# EAGLE design Beacon_controller_ESP32 (EAGLE 9.2.2)
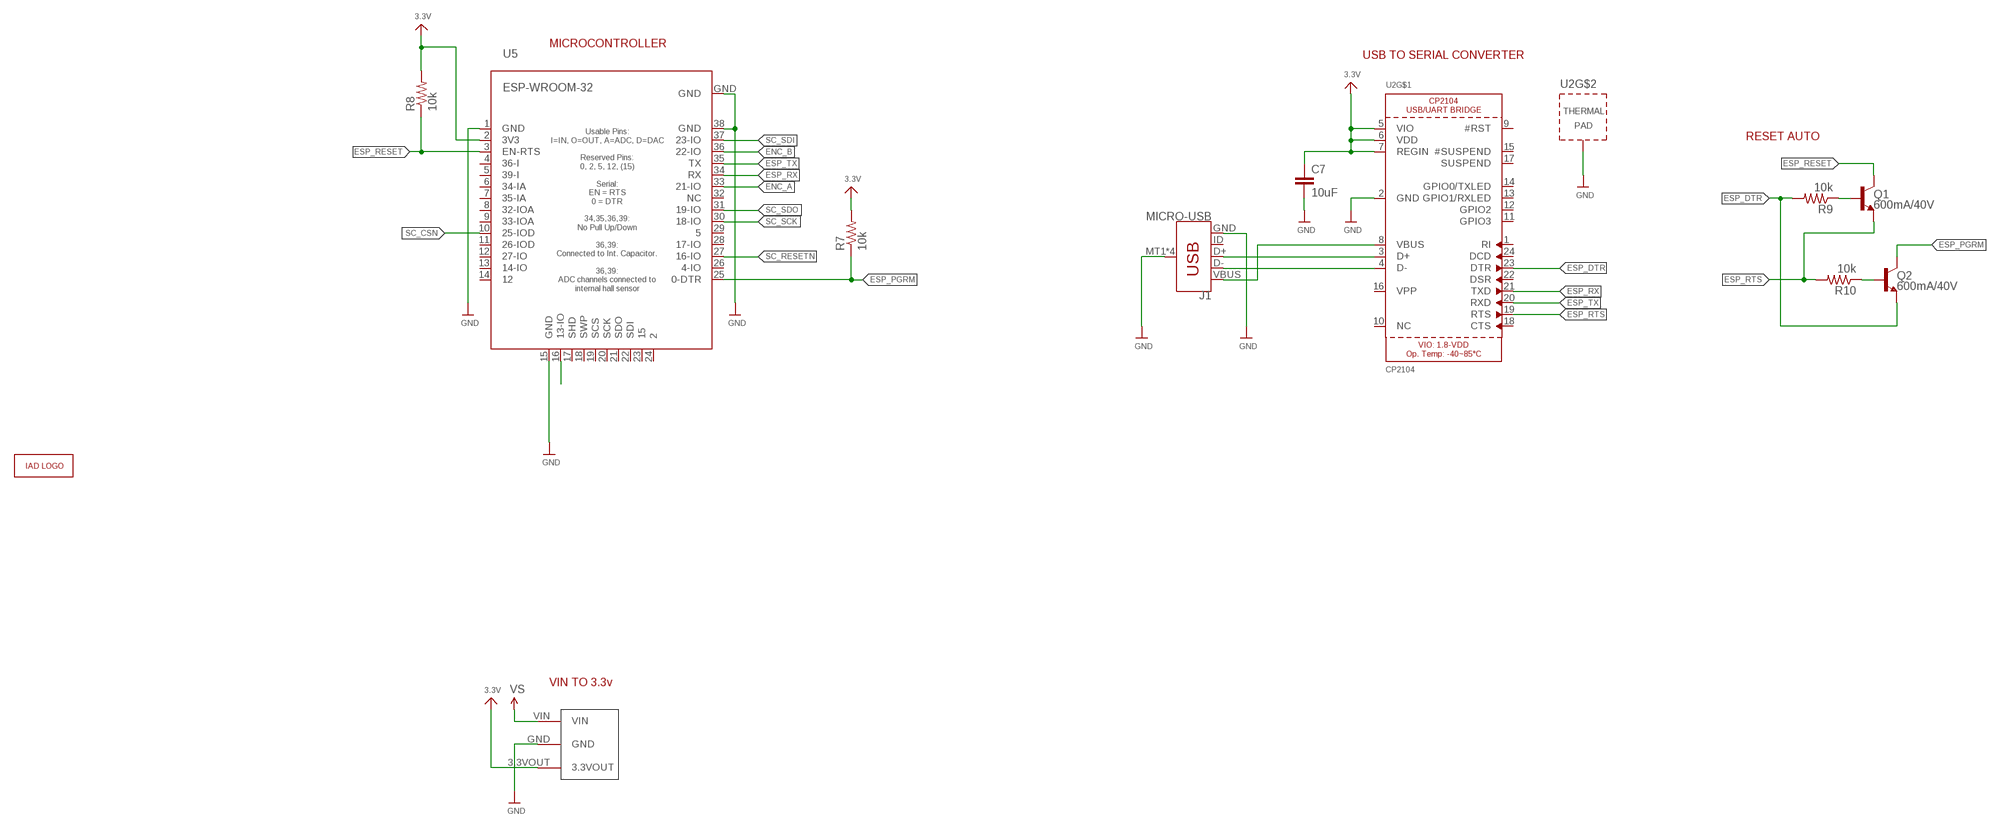
[diagram p0: schematic, sheet 1]

## Parts
A1  ZHDK_LOGO_METAL  [ZHDK_LOGO]
C7  10uF  10UF-0603-6.3V-20%  [0603]
J1  MICRO-USB  USB_MICRO-B_SMT  [USB-MICROB]
Q1  600mA/40V  TRANS_NPN-MMBT2222AL  [SOT23-3]
Q2  600mA/40V  TRANS_NPN-MMBT2222AL  [SOT23-3]
R7  10k  RESISTOR0603-RES  [0603-RES]
R8  10k  RESISTOR0603-RES  [0603-RES]
R9  10k  RESISTOR0603-RES  [0603-RES]
R10  10k  RESISTOR0603-RES  [0603-RES]
U2  CP2104  [QFN24_4MM_SMSC]
U4  TRACO12433  [TRACO12433]
U5  ESP-WROOM-32  [ESP-WROOM-32]

## Nets
3.3V: C7.1 R7.2 R8.2 U2.5(VIO) U2.6(VDD) U2.7(REGIN) U4.3.3VOUT U5.2(3V3)
BTN_HOME: U5.16(13-IO)
ENC_A: U5.33(21-IO)
ENC_B: U5.36(22-IO)
ESP_DTR: Q2.2(E) R9.2 U2.23(DTR)
ESP_PGRM: Q2.3(C) R7.1 U5.25(0-DTR)
ESP_RESET: Q1.3(C) R8.1 U5.3(EN-RTS)
ESP_RTS: Q1.2(E) R10.2 U2.19(RTS)
ESP_RX: U2.21(TXD) U5.34(RX)
ESP_TX: U2.20(RXD) U5.35(TX)
GND: C7.2 J1.GND J1.MT1(SHIELD) J1.MT2(SHIELD) J1.P$1(SHIELD) J1.P$2(SHIELD) U2.2(GND) U2.THERM(TP) U4.GND U5.1(GND) U5.15(GND) U5.38(GND) U5.GND
N$1: J1.VBUS U2.8(VBUS)
N$13: J1.D+ U2.3(D+)
N$14: J1.D- U2.4(D-)
N$22: Q1.1(B) R9.1
N$23: Q2.1(B) R10.1
SC_CSN: U5.10(25-IOD)
SC_RESETN: U5.27(16-IO)
SC_SCK: U5.30(18-IO)
SC_SDI: U5.37(23-IO)
SC_SDO: U5.31(19-IO)
VS: U4.VIN
Unconnected: J1.ID U2.1(RI) U2.9(#RST) U2.10(NC) U2.11(GPIO3) U2.12(GPIO2) U2.13(GPIO1/RXLED) U2.14(GPIO0/TXLED) U2.15(#SUSPEND) U2.16(VPP) U2.17(SUSPEND) U2.18(CTS) U2.22(DSR) U2.24(DCD) U5.4(36-I) U5.5(39-I) U5.6(34-IA) U5.7(35-IA) U5.8(32-IOA) U5.9(33-IOA) U5.11(26-IOD) U5.12(27-IO) U5.13(14-IO) U5.14 U5.17(SHD) U5.18(SWP) U5.19(SCS) U5.20(SCK) U5.21(SDO) U5.22(SDI) U5.23 U5.24 U5.26(4-IO) U5.28(17-IO) U5.29 U5.32(NC)

## Notes on the sheet
- FIX: External power requirement to flash the device. Actually, the esp32 is powered somehow through the usb bridge...
- MICROCONTROLLER
- USB TO SERIAL CONVERTER
- RESET AUTO
- VIN TO 3.3v

## Library data of the parts
A1 = IAD_GRAPHIC:ZHDK_LOGO_METAL
C7 = SparkFun-Capacitors:10UF: 10.0µF ceramic capacitors A capacitor is a passive two-terminal electrical component used to store electrical energy temporarily in an electric field.; PROD_ID: CAP-11015
J1 = SparkFun-Connectors:USB_MICRO-B: USB Type Micro-B Connector Male/female and PTH/SMT variants SparkFun Products: SparkFun microB USB Breakout <https://www.sparkfun.com/products/12035> SparkFun USB microB Plug Breakout <https://www.sparkfun.com/products/10031> SparkFun ESP8266 Thing <https://www.sparkfun.com/products/13231>; PROD_ID: CONN-09505; SF_ID: PRT-08533
Q1 Q2 = SparkFun-DiscreteSemi:TRANS_NPN: NPN transistor Current controlled devices typically used to amplify current or used as a switch. BC547 - COM-08928 <http://www.sparkfun.com/products/8928> (TO-92 45V 100mA) (1.Collector 2.Base 3.Emitter) 2N3904 - COM-00521 <http://www.sparkfun.com/products/521> (TO-92 40V 200mA) (1.Emitter 2.Base 3.Collector) P2N2222A - COM-12852 <http://www.sparkfun.com/products/12852> (TO-92 40V 600mA) (1.Collector 2.Base 3.Emitter); PROD_ID: TRANS-08049
R7-R10 = SparkFun-Passives:RESISTOR: Resistor Basic schematic elements and footprints for 0603, 1206, and PTH resistors.
U2 = microbuilder:CP2104: CP2104 - USB to UART Bridge VDD Output: 3.45V
U4 = IAD_ZHDK:TRACO12433
U5 = esp32:ESP-WROOM-32

## Board
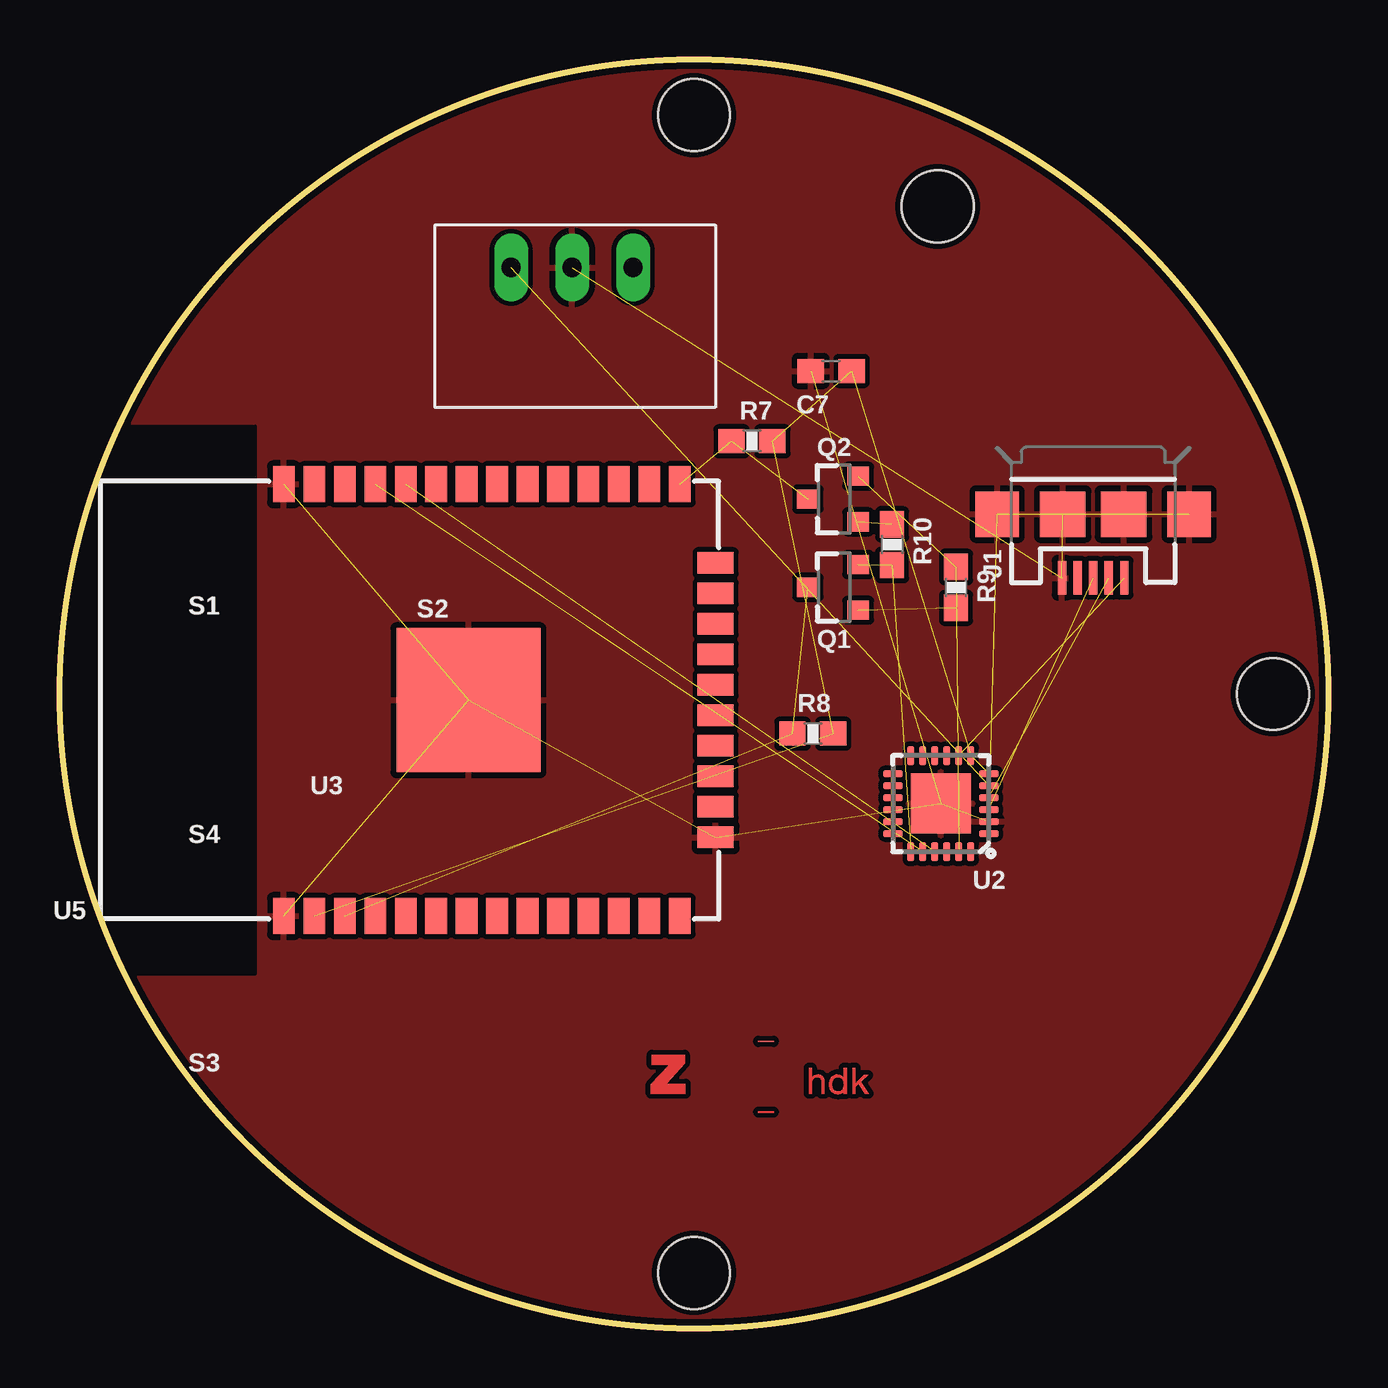
[diagram p1: board, top side]
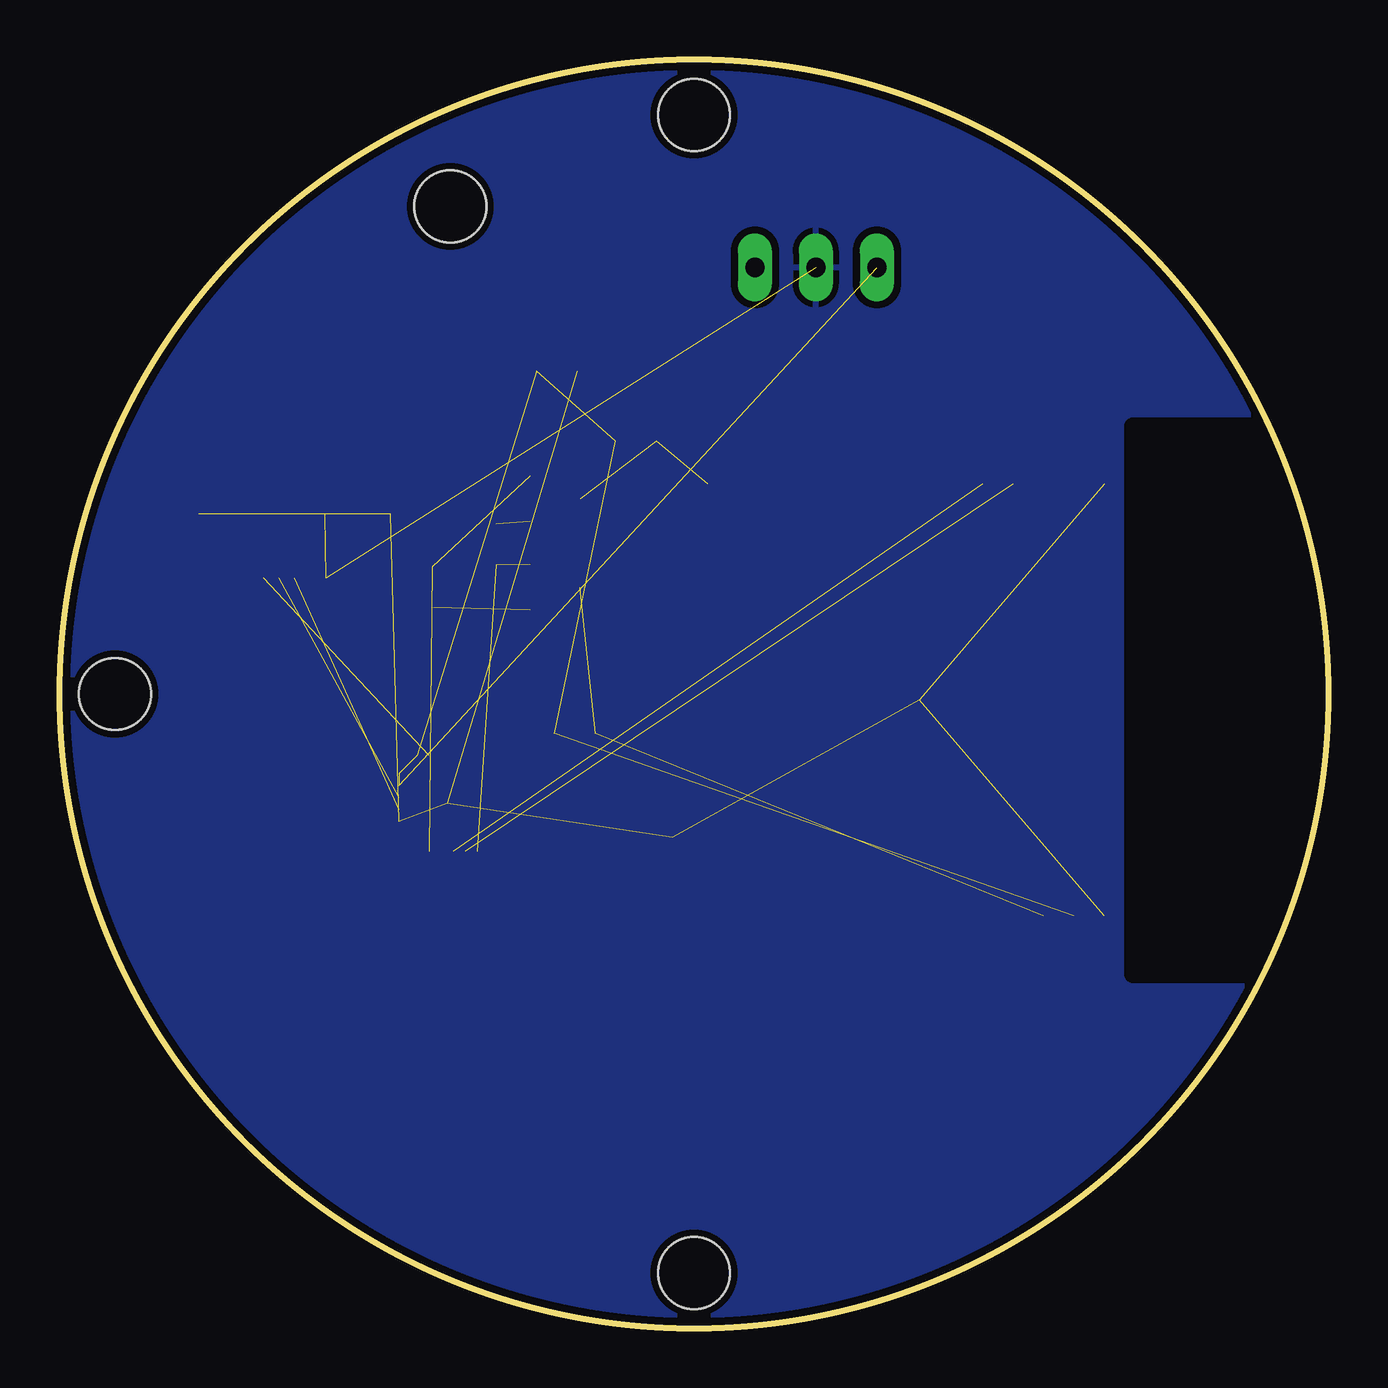
[diagram p2: board, bottom side, seen from below]

Size 52.85 x 52.85 mm. Coordinates in mm from the lower left corner, seen from the top.
Outline: circle at 26.43,26.43 radius 26.43
Copper layers (1*16): Top 0.035mm / dielectric 1.5mm / Bottom 0.035mm
Design rules "SparkFun *": minimum track width 8mil, minimum drill 15mil, track to track 8mil, track to pad 12mil, pad to pad 8mil, via to via 16mil, smd to smd 8mil, copper to edge 10mil, drill to drill 8mil, minimum pad ring 12mil, minimum via ring 10mil, stop-mask expansion 4mil, vias tented up to drill 25mil, thermal gap 10mil
Holes 3 mm at 36.59,46.75 26.43,2.3 50.56,26.43 26.43,50.56

### Footprints (pad centres in the part's own frame; a part is rotated, then mirrored left to right if it is on the bottom)
0603 = smd 1.1 x 1: 1 -0.85,0; 2 0.85,0
USB-MICROB = smd 1.4 x 0.35: D+ -2.65,0; D- -2.65,-0.65; GND -2.65,1.3; ID -2.65,0.65; VBUS -2.65,-1.3 | smd 1.9 x 1.8: MT1 0,-4; MT2 0,4 | smd 1.9 x 1.9: P$1 0,-1.27; P$2 0,1.27
SOT23-3 = smd 0.8 x 0.9: 1 -0.95,-1; 2 0.95,-1; 3 0,1.1
0603-RES = smd 1.1 x 1: 1 -0.85,0; 2 0.85,0
QFN24_4MM_SMSC = smd 0.8 x 0.28: 1 -2,1.25; 2 -2,0.75; 3 -2,0.25; 4 -2,-0.25; 5 -2,-0.75; 6 -2,-1.25; 13 2,-1.25; 14 2,-0.75; 15 2,-0.25; 16 2,0.25; 17 2,0.75; 18 2,1.25 | smd 0.28 x 0.8: 7 -1.25,-2; 8 -0.75,-2; 9 -0.25,-2; 10 0.25,-2; 11 0.75,-2; 12 1.25,-2; 19 1.25,2; 20 0.75,2; 21 0.25,2; 22 -0.25,2; 23 -0.75,2; 24 -1.25,2 | smd 2.5 x 2.5: THERM 0,0
TRACO12433 = drill 0.8 long: 3.3VOUT 0,-2.54; GND 0,0; VIN 0,2.54
ESP-WROOM-32 = smd 0.9 x 1.5: 1 7.7,9; 2 6.43,9; 3 5.16,9; 4 3.89,9; 5 2.62,9; 6 1.35,9; 7 0.08,9; 8 -1.19,9; 9 -2.46,9; 10 -3.73,9; 11 -5,9; 12 -6.27,9; 13 -7.54,9; 14 -8.81,9; 25 -8.81,-9; 26 -7.54,-9; 27 -6.27,-9; 28 -5,-9; 29 -3.73,-9; 30 -2.46,-9; 31 -1.19,-9; 32 0.08,-9; 33 1.35,-9; 34 2.62,-9; 35 3.89,-9; 36 5.16,-9; 37 6.43,-9; 38 7.7,-9 | smd 1.5 x 0.9: 15 -10.3,5.715; 16 -10.3,4.445; 17 -10.3,3.175; 18 -10.3,1.905; 19 -10.3,0.635; 20 -10.3,-0.635; 21 -10.3,-1.905; 22 -10.3,-3.175; 23 -10.3,-4.445; 24 -10.3,-5.715 | smd 6 x 6: GND 0,0

### Placement (x,y rotation side)
A1  23.89,11.95 0 top
C7  32.14,39.89 180 top
J1  43.06,33.92 90 top
Q1  32.27,30.87 90 top
Q2  32.27,34.55 90 top
R7  28.84,36.97 0 top
R8  31.38,24.78 0 top
R9  37.35,30.87 90 top
R10  34.68,32.65 270 top
U2  36.71,21.85 180 top
U4  21.35,44.21 270 top
U5  17.03,26.17 180 top

### Tracks (layer width: path | path; a pad name or v marks a point on that pad's centre or on a via)
3.3V  (7 unrouted)
ESP_DTR  (2 unrouted)
ESP_PGRM  (2 unrouted)
ESP_RESET  (2 unrouted)
ESP_RTS  (2 unrouted)
ESP_RX  (1 unrouted)
ESP_TX  (1 unrouted)
GND  (12 unrouted)
  pour Bottom (isolate 0.305, rank 3): -1.51,53.1 -1.51,-1.51 54.37,-1.51 54.37,53.1
  pour Top: 55.64,54.37 55.64,-4.05 -2.78,-4.05 -2.78,54.37
N$1  (1 unrouted)
N$13  (1 unrouted)
N$14  (1 unrouted)
N$22  (1 unrouted)
N$23  (1 unrouted)

### Text on the board
tNames: S1 | S2 | U4 | U3 | S4 | S3